# Altium schematic sheet project_overview.SchDoc
size A3; SheetNumber: 1; SheetTotal: 6
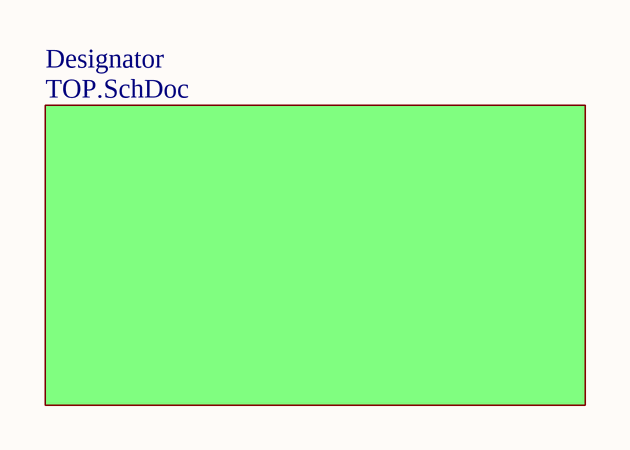
[diagram p0: project_overview.SchDoc]

## Sub-sheets
Designator = TOP.SchDoc: no entries